# EAGLE design EXP_TMS9918A_V1 (EAGLE 9.6.2)
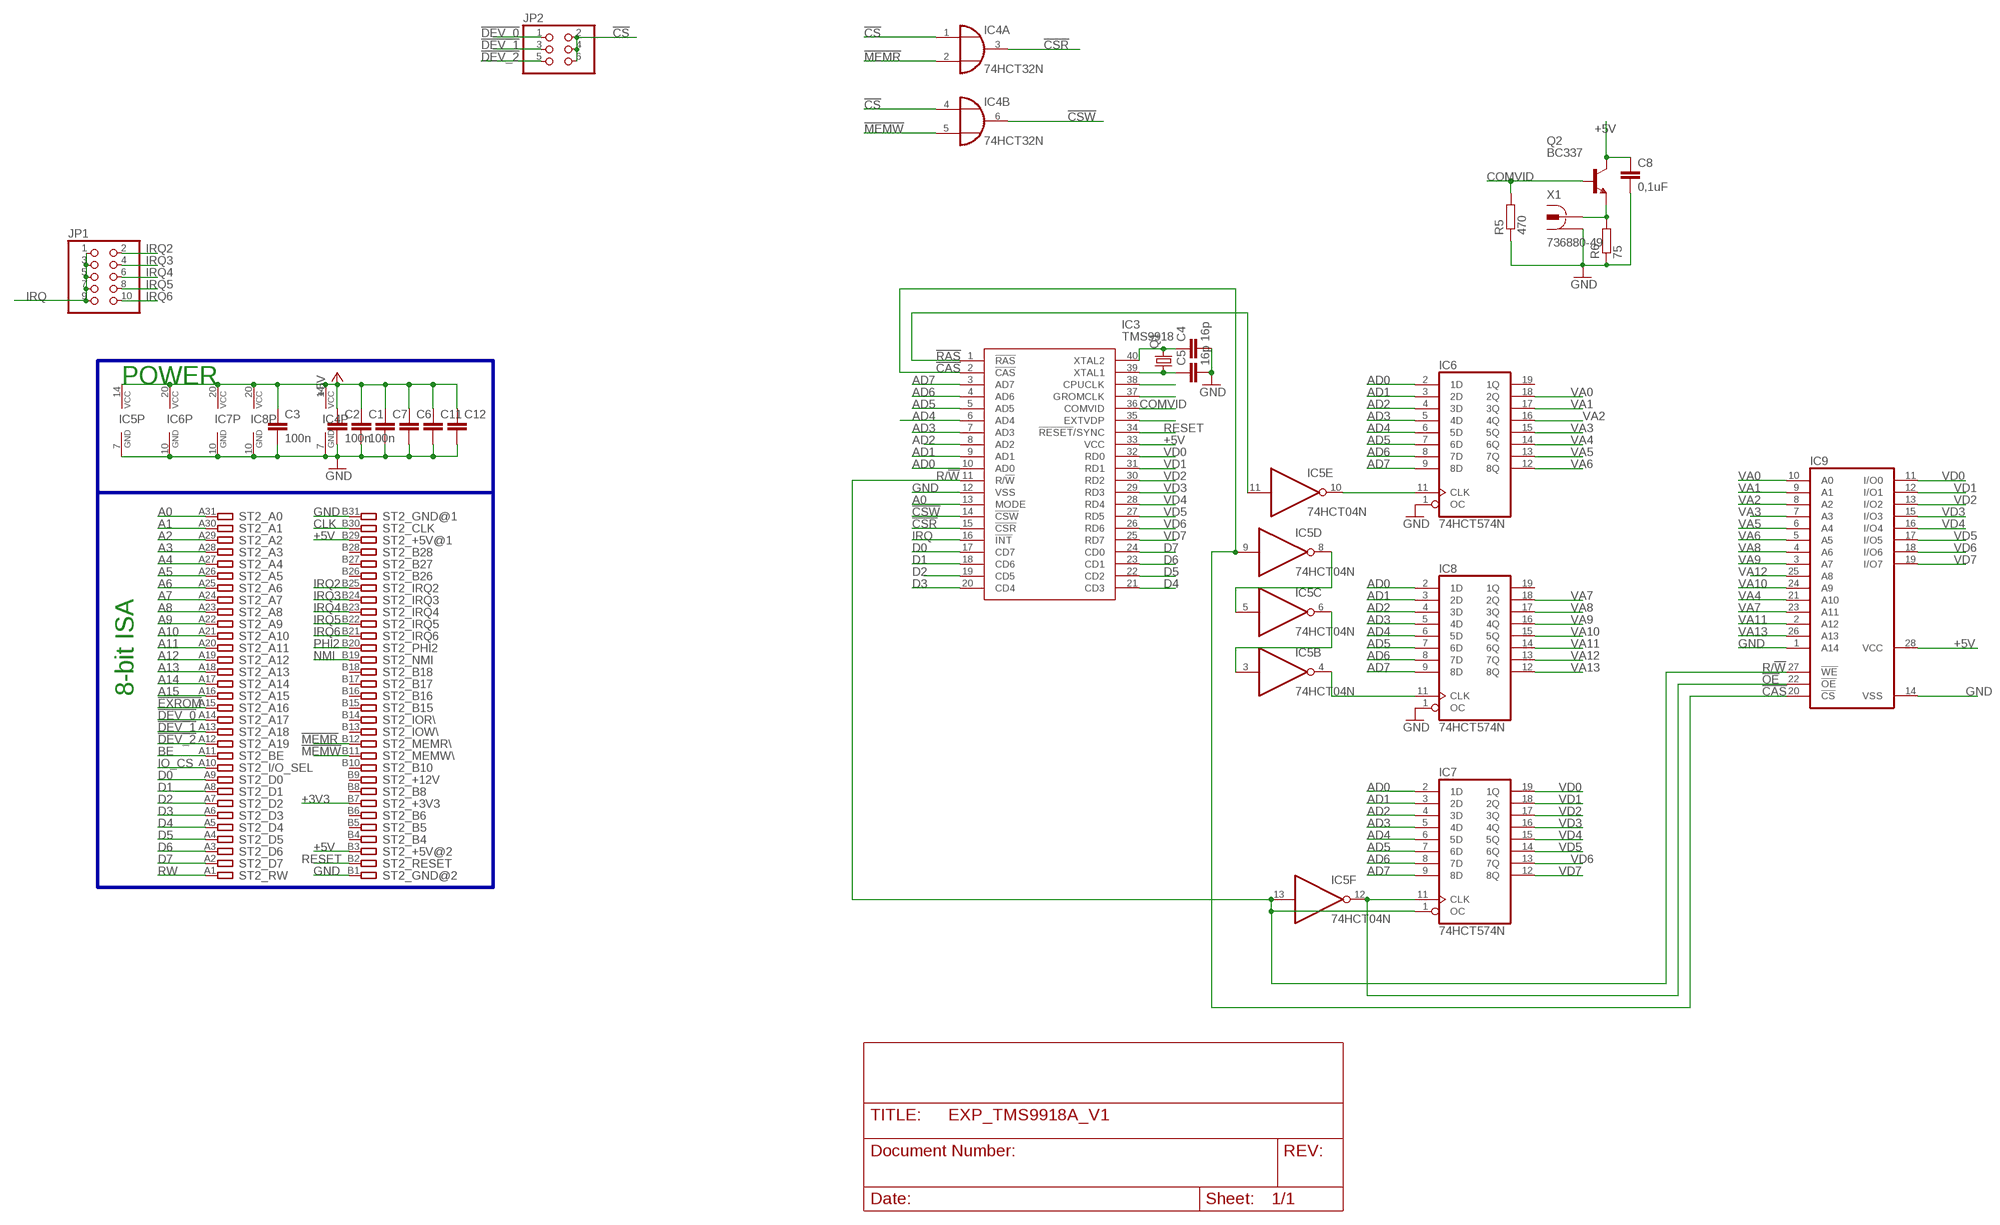
[diagram p0: schematic, sheet 1]

## Parts
C1  100n  C-EU050-025X075  [C050-025X075]
C2  100n  C-EU050-025X075  [C050-025X075]
C3  100n  C-EU050-025X075  [C050-025X075]
C4  16p  C-EU050-024X044  [C050-024X044]
C5  16p  C-EU050-024X044  [C050-024X044]
C6  C-EU050-035X075  [C050-035X075]
C7  C-EU050-035X075  [C050-035X075]
C8  0,1uF  C-EU050-024X044  [C050-024X044]
C11  C-EU050-035X075  [C050-035X075]
C12  C-EU050-035X075  [C050-035X075]
IC3  TMS9918  [DIP1524W53P254L5310H508Q40N]
IC4  74HCT32N  [DIL14]
IC5  74HCT04N  [DIL14]
IC6  74HCT574N  [DIL20]
IC7  74HCT574N  [DIL20]
IC8  74HCT574N  [DIL20]
IC9  62256P  [DIL28-6]
JP1  PINHD-2X5  [2X05]
JP2  PINHD-2X3  [2X03]
Q1  CRYSTALHC49S  [HC49/S]
Q2  BC337  [TO92]
R5  470  R-EU_0207/7  [0207/7]
R6  75  R-EU_0207/7  [0207/7]
ST2  IBM8BIT_ISASHORT  [APP_2X32_SHORT]
X1  736880-49  [736880-49]

## Nets
!CAS: IC3.2(!CAS) IC5.9(D:I) IC9.20(!CS)
!CS: IC4.1(A:I0) IC4.4(B:I0) JP2.2 JP2.4 JP2.6
!CSR: IC3.15(!CSR) IC4.3(A:O)
!CSW: IC3.14(!CSW) IC4.6(B:O)
!DEV_0: JP2.1 ST2.A14
!DEV_1: JP2.3 ST2.A13
!DEV_2: JP2.5 ST2.A12
!EXROM: ST2.A15
!MEMR: IC4.2(A:I1) ST2.B12
!MEMW: IC4.5(B:I1) ST2.B11
!OE: IC5.12(F:O) IC7.11(CLK) IC9.22(!OE)
!RAS: IC3.1(!RAS) IC5.11(E:I)
+3V3: ST2.B7
+5V [power]: C1.1 C2.1 C3.1 C6.1 C7.1 C8.1 C11.1 C12.1 IC3.33(VCC) IC4.14(P:VCC) IC5.14(P:VCC) IC6.20(VCC) IC7.20(VCC) IC8.20(VCC) IC9.28(VCC) Q2.3(C) ST2.B3 ST2.B29
A0: IC3.13(MODE) ST2.A31
A1: ST2.A30
A2: ST2.A29
A3: ST2.A28
A4: ST2.A27
A5: ST2.A26
A6: ST2.A25
A7: ST2.A24
A8: ST2.A23
A9: ST2.A22
A10: ST2.A21
A11: ST2.A20
A12: ST2.A19
A13: ST2.A18
A14: ST2.A17
A15: ST2.A16
AD0: IC3.10(AD0) IC6.2(1D) IC7.2(1D) IC8.2(1D)
AD1: IC3.9(AD1) IC6.3(2D) IC7.3(2D) IC8.3(2D)
AD2: IC3.8(AD2) IC6.4(3D) IC7.4(3D) IC8.4(3D)
AD3: IC3.7(AD3) IC6.5(4D) IC7.5(4D) IC8.5(4D)
AD4: IC3.6(AD4) IC6.6(5D) IC7.6(5D) IC8.6(5D)
AD5: IC3.5(AD5) IC6.7(6D) IC7.7(6D) IC8.7(6D)
AD6: IC3.4(AD6) IC6.8(7D) IC7.8(7D) IC8.8(7D)
AD7: IC3.3(AD7) IC6.9(8D) IC7.9(8D) IC8.9(8D)
BE: ST2.A11
CLK: ST2.B30
COMVID: IC3.36(COMVID) Q2.2(B) R5.2
D0: IC3.17(CD7) ST2.A9
D1: IC3.18(CD6) ST2.A8
D2: IC3.19(CD5) ST2.A7
D3: IC3.20(CD4) ST2.A6
D4: IC3.21(CD3) ST2.A5
D5: IC3.22(CD2) ST2.A4
D6: IC3.23(CD1) ST2.A3
D7: IC3.24(CD0) ST2.A2
GND [power]: C1.2 C2.2 C3.2 C4.2 C5.2 C6.2 C7.2 C8.2 C11.2 C12.2 IC3.12(VSS) IC4.7(P:GND) IC5.7(P:GND) IC6.1(OC) IC6.10(GND) IC7.10(GND) IC8.1(OC) IC8.10(GND) IC9.1(A14) IC9.14(VSS) R5.1 R6.1 ST2.B1 ST2.B31 X1.1 X1.1@1 X1.1@2
IO_CS: ST2.A10
IRQ: IC3.16(!INT) JP1.1 JP1.3 JP1.5 JP1.7 JP1.9
IRQ2: JP1.2 ST2.B25
IRQ3: JP1.4 ST2.B24
IRQ4: JP1.6 ST2.B23
IRQ5: JP1.8 ST2.B22
IRQ6: JP1.10 ST2.B21
N$3: Q2.1(E) R6.2 X1.2
N$14: IC5.10(E:O) IC6.11(CLK)
N$15: IC5.5(C:I) IC5.8(D:O)
N$16: IC5.3(B:I) IC5.6(C:O)
N$17: IC5.4(B:O) IC8.11(CLK)
N$22: C4.1 IC3.40(XTAL2) Q1.2
N$23: C5.1 IC3.39(XTAL1) Q1.1
N$24: IC3.38(CPUCLK)
N$25: IC3.37(GROMCLK)
N$27: IC3.35(EXTVDP)
NMI: ST2.B19
PHI2: ST2.B20
R/!W: IC3.11(R/!W) IC5.13(F:I) IC7.1(OC) IC9.27(!WE)
RESET: IC3.34(!RESET!/SYNC) ST2.B2
RW: ST2.A1
VA0: IC6.18(2Q) IC9.10(A0)
VA1: IC6.17(3Q) IC9.9(A1)
VA2: IC6.16(4Q) IC9.8(A2)
VA3: IC6.15(5Q) IC9.7(A3)
VA4: IC6.14(6Q) IC9.21(A10)
VA5: IC6.13(7Q) IC9.6(A4)
VA6: IC6.12(8Q) IC9.5(A5)
VA7: IC8.18(2Q) IC9.23(A11)
VA8: IC8.17(3Q) IC9.4(A6)
VA9: IC8.16(4Q) IC9.3(A7)
VA10: IC8.15(5Q) IC9.24(A9)
VA11: IC8.14(6Q) IC9.2(A12)
VA12: IC8.13(7Q) IC9.25(A8)
VA13: IC8.12(8Q) IC9.26(A13)
VD0: IC3.32(RD0) IC7.19(1Q) IC9.11(I/O0)
VD1: IC3.31(RD1) IC7.18(2Q) IC9.12(I/O1)
VD2: IC3.30(RD2) IC7.17(3Q) IC9.13(I/O2)
VD3: IC3.29(RD3) IC7.16(4Q) IC9.15(I/O3)
VD4: IC3.28(RD4) IC7.15(5Q) IC9.16(I/O4)
VD5: IC3.27(RD5) IC7.14(6Q) IC9.17(I/O5)
VD6: IC3.26(RD6) IC7.13(7Q) IC9.18(I/O6)
VD7: IC3.25(RD7) IC7.12(8Q) IC9.19(I/O7)
Unconnected: IC4.8(C:O) IC4.9(C:I0) IC4.10(C:I1) IC4.11(D:O) IC4.12(D:I0) IC4.13(D:I1) IC5.1(A:I) IC5.2(A:O) IC6.19(1Q) IC8.19(1Q) ST2.B4 ST2.B5 ST2.B6 ST2.B8 ST2.B9 ST2.B10 ST2.B13 ST2.B14 ST2.B15 ST2.B16 ST2.B17 ST2.B18 ST2.B26 ST2.B27 ST2.B28

## Buses
A8,A9,A10,A11,ACIA_CS,IO_CS,IO_CS_N,N$3,N$4,N$8

## Notes on the sheet
- POWER
- 8-bit ISA

## Library data of the parts
C1-C3 = rcl:C-EU: CAPACITOR, European symbol
C4-C8 C11 C12 = rcl:C-EU: CAPACITOR, European symbol; SPICEPREFIX: C
IC3 = TMS9918:TMS9918: Video Display Processor, DIP-40 Source: Datasheet <http://www.bitsavers.org/components/ti/TMS9900/TMS9918A_TMS9928A_TMS9929A_Video_Display_Processors_Data_Manual_Nov82.pdf>; DESCRIPTION: Video Display Processor, DIP-40; HEIGHT: 5.08mm; MANUFACTURER_NAME: Texas Instruments; MANUFACTURER_PART_NUMBER: TMS9918
IC4 = 74xx-eu:74*32: Quad 2-input OR gate
IC5 = 74xx-eu:74*04: Hex INVERTER
IC6-IC8 = 74xx-eu:74*574: 8-bit D type FLIP FLOP bus driver
IC9 = memory-hitachi:62256P: MEMORY; OC_FARNELL: unknown; OC_NEWARK: unknown
JP1 = pinhead:PINHD-2X5: PIN HEADER
JP2 = pinhead:PINHD-2X3: PIN HEADER
Q1 = crystal:CRYSTAL: CRYSTAL; OC_FARNELL: 1667008; OC_NEWARK: unknown
Q2 = transistor-npn:BC337*: NPN Transistor
R5 R6 = rcl:R-EU_: RESISTOR, European symbol; SPICEPREFIX: R
ST2 = TiRoRiN_Libs:IBM8BIT_ISA: 8-bit CARD IBM/PC-AT
X1 = con-conrad:736880-49: Cinch Connector ( RCA Jack ) Cinch-Einbaukupplung 90º 72345 Vernickelt BKL Electronic Source: Conrad <http://www.conrad.de/ce/de/product/736880>

## Net classes
0 default: width 0.381 mm, drill 0.2 mm, clearance 0.254 mm
1 power: width 0.508 mm, drill 0.66 mm, clearance 0.254 mm to class 0, clearance 0.254 mm
2 data: width 0.381 mm, drill 0.66 mm, clearance 0.254 mm to class 0, clearance 0.254 mm to class 1, clearance 0.254 mm

## Board
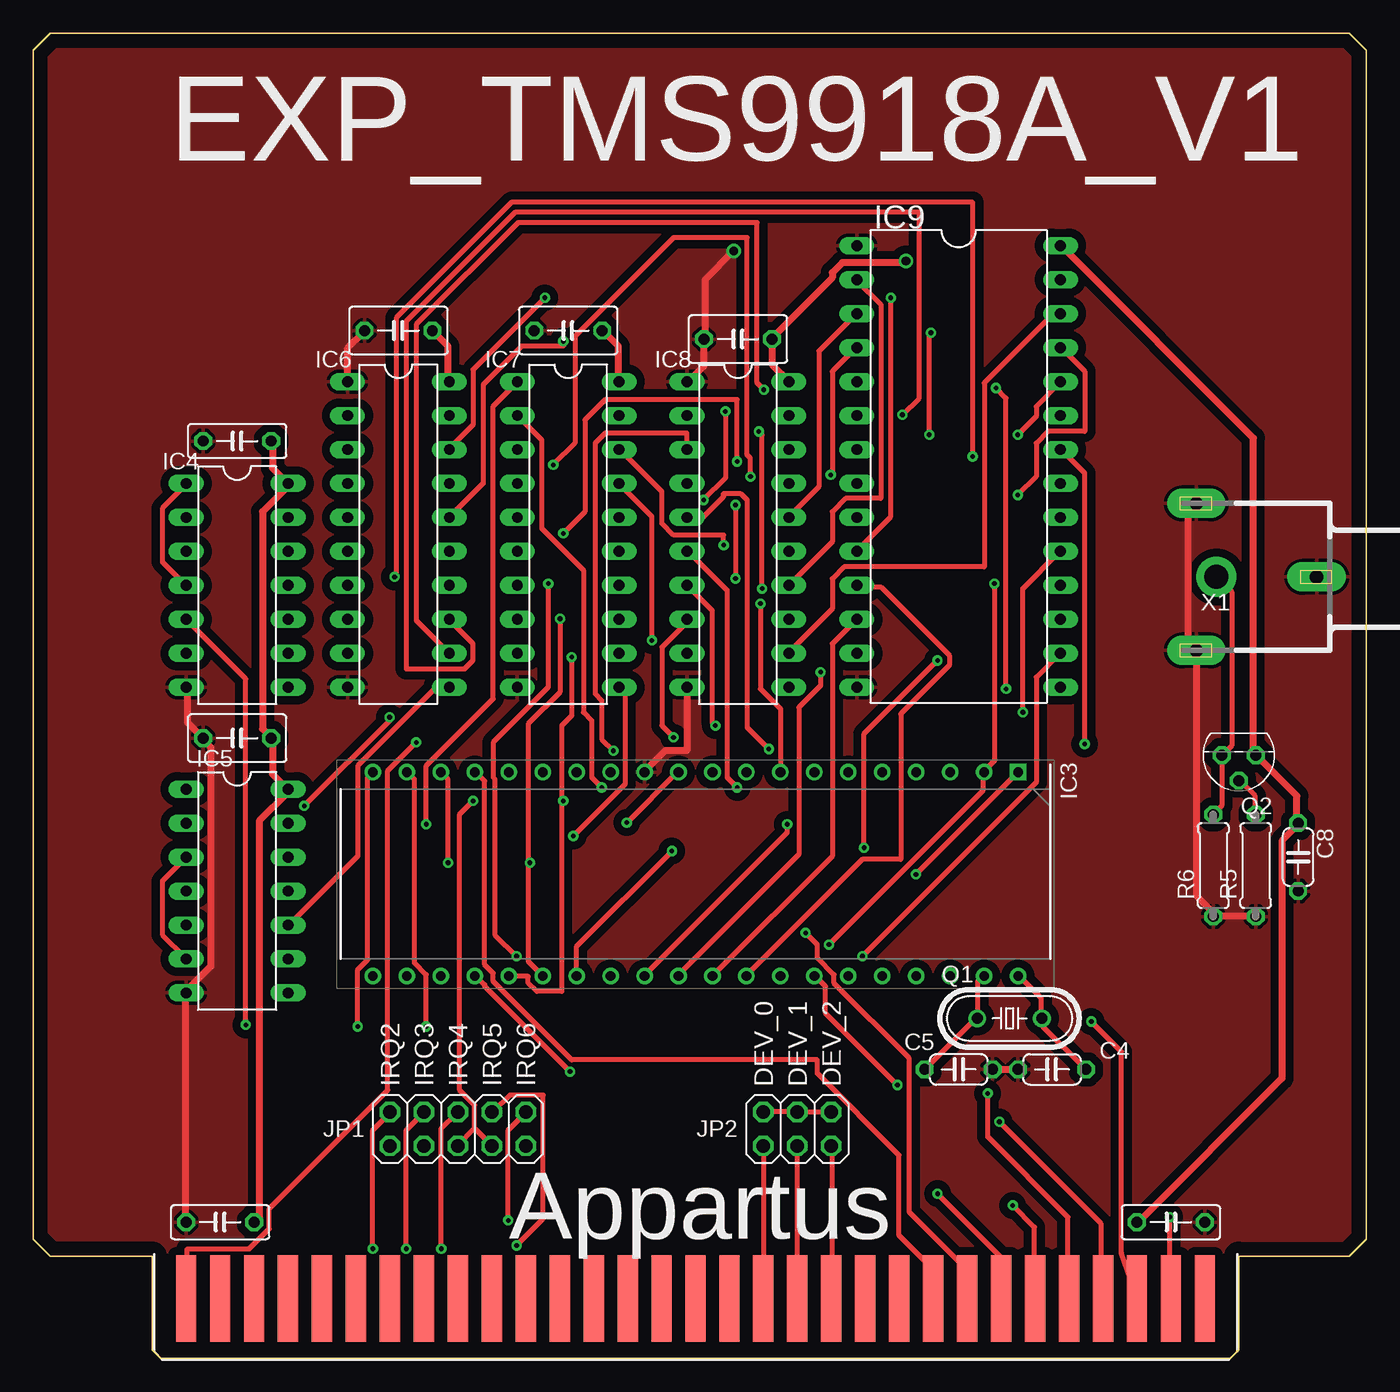
[diagram p1: board, top side]
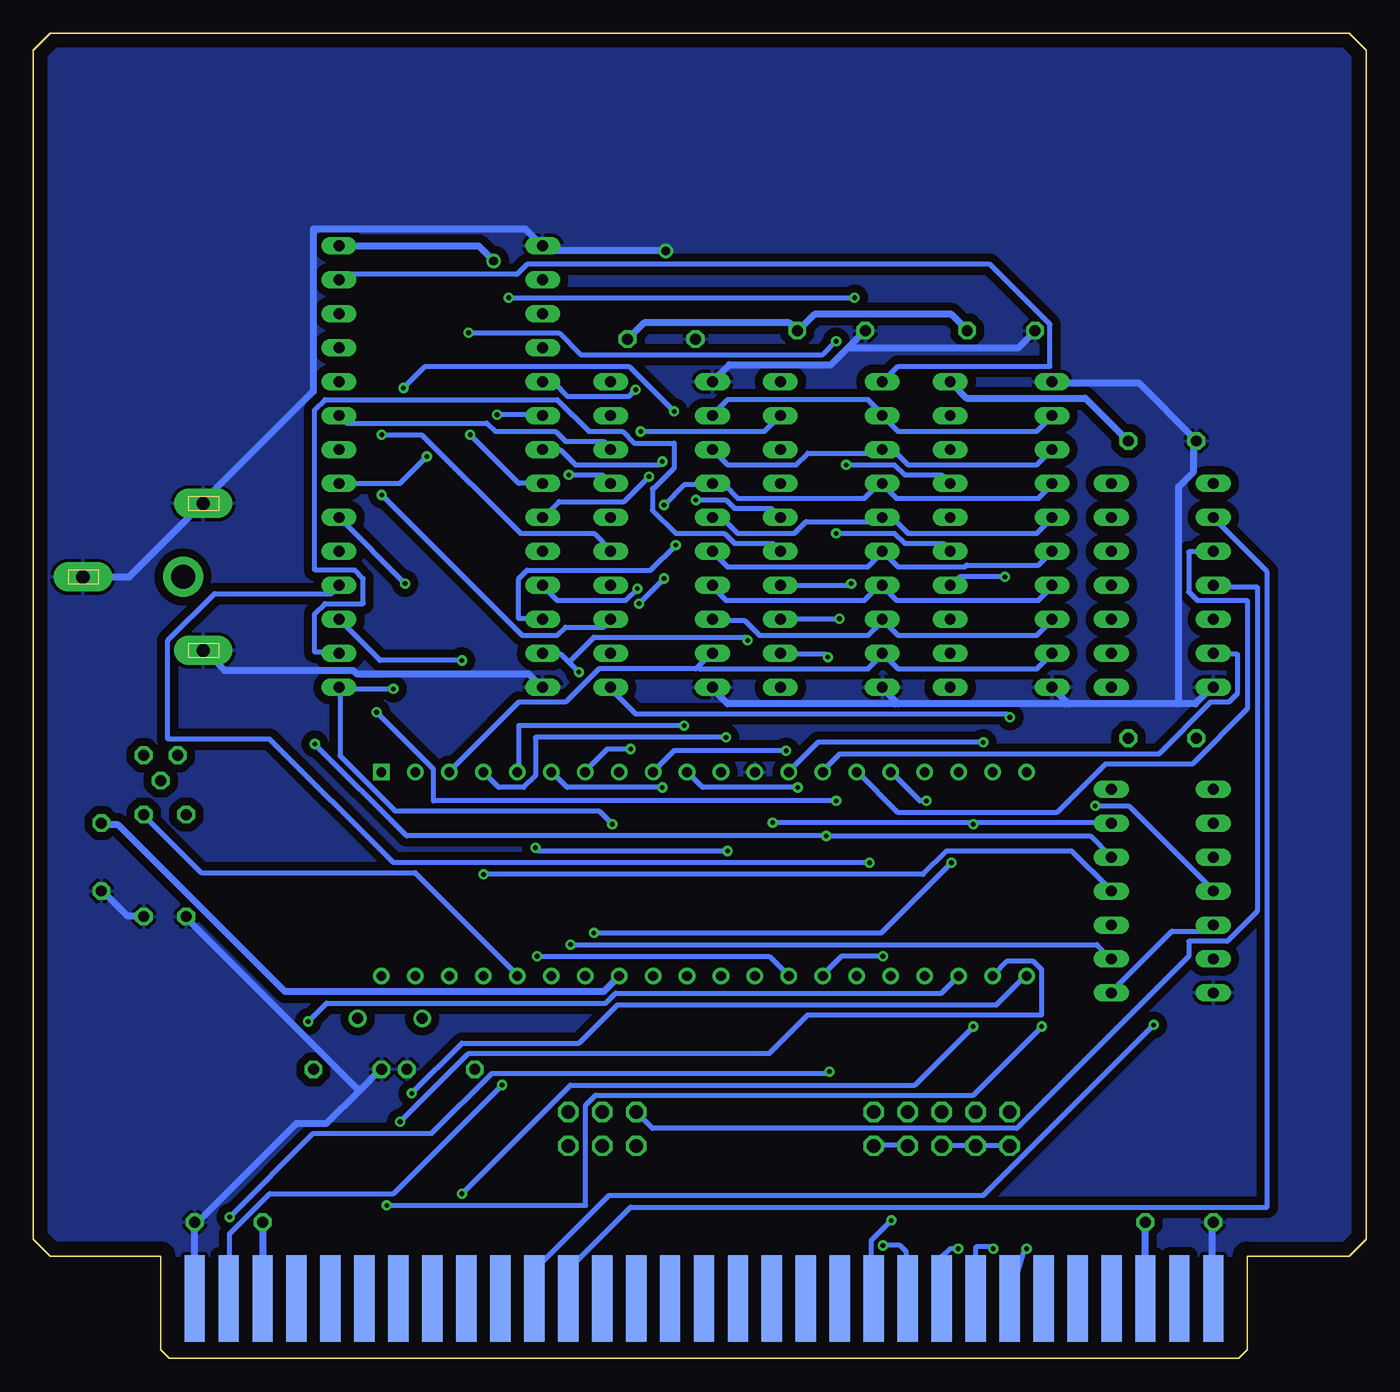
[diagram p2: board, bottom side, seen from below]

Size 99.7 x 99.06 mm. Coordinates in mm from the lower left corner, seen from the top.
Copper layers (1*16): Top 0.035mm / dielectric 1.5mm / Bottom 0.035mm
Design rules "appartus": minimum track width 6mil, minimum drill 0.35mm, track to track 6mil, track to pad 6mil, pad to pad 6mil, via to via 6mil, smd to smd 6mil, copper to edge 40mil, drill to drill 6mil, minimum pad ring 10mil, minimum via ring 8mil, stop-mask expansion 4mil, vias tented up to drill 0mil, thermal gap 10mil

### Footprints (pad centres in the part's own frame; a part is rotated, then mirrored left to right if it is on the bottom)
C050-025X075 = drill 0.813 octagon: 1 -2.54,0; 2 2.54,0
C050-024X044 = drill 0.813 octagon: 1 -2.54,0; 2 2.54,0
C050-035X075 = drill 0.813 octagon: 1 -2.54,0; 2 2.54,0
DIP1524W53P254L5310H508Q40N = drill 0.733 pad 1.133 square: 1 -7.62,24.13 | drill 0.733 pad 1.133: 2 -7.62,21.59; 3 -7.62,19.05; 4 -7.62,16.51; 5 -7.62,13.97; 6 -7.62,11.43; 7 -7.62,8.89; 8 -7.62,6.35; 9 -7.62,3.81; 10 -7.62,1.27; 11 -7.62,-1.27; 12 -7.62,-3.81; 13 -7.62,-6.35; 14 -7.62,-8.89; 15 -7.62,-11.43; 16 -7.62,-13.97; 17 -7.62,-16.51; 18 -7.62,-19.05; 19 -7.62,-21.59; 20 -7.62,-24.13; 21 7.62,-24.13; 22 7.62,-21.59; 23 7.62,-19.05; 24 7.62,-16.51; 25 7.62,-13.97; 26 7.62,-11.43; 27 7.62,-8.89; 28 7.62,-6.35; 29 7.62,-3.81; 30 7.62,-1.27; 31 7.62,1.27; 32 7.62,3.81; 33 7.62,6.35; 34 7.62,8.89; 35 7.62,11.43; 36 7.62,13.97; 37 7.62,16.51; 38 7.62,19.05; 39 7.62,21.59; 40 7.62,24.13
DIL14 = drill 0.813 long: 1 -7.62,-3.81; 2 -5.08,-3.81; 3 -2.54,-3.81; 4 0,-3.81; 5 2.54,-3.81; 6 5.08,-3.81; 7 7.62,-3.81; 8 7.62,3.81; 9 5.08,3.81; 10 2.54,3.81; 11 0,3.81; 12 -2.54,3.81; 13 -5.08,3.81; 14 -7.62,3.81
DIL20 = drill 0.813 long: 1 -11.43,-3.81; 2 -8.89,-3.81; 3 -6.35,-3.81; 4 -3.81,-3.81; 5 -1.27,-3.81; 6 1.27,-3.81; 7 3.81,-3.81; 8 6.35,-3.81; 9 8.89,-3.81; 10 11.43,-3.81; 11 11.43,3.81; 12 8.89,3.81; 13 6.35,3.81; 14 3.81,3.81; 15 1.27,3.81; 16 -1.27,3.81; 17 -3.81,3.81; 18 -6.35,3.81; 19 -8.89,3.81; 20 -11.43,3.81
DIL28-6 = drill 0.813 long: 1 -16.51,-7.62; 2 -13.97,-7.62; 3 -11.43,-7.62; 4 -8.89,-7.62; 5 -6.35,-7.62; 6 -3.81,-7.62; 7 -1.27,-7.62; 8 1.27,-7.62; 9 3.81,-7.62; 10 6.35,-7.62; 11 8.89,-7.62; 12 11.43,-7.62; 13 13.97,-7.62; 14 16.51,-7.62; 15 16.51,7.62; 16 13.97,7.62; 17 11.43,7.62; 18 8.89,7.62; 19 6.35,7.62; 20 3.81,7.62; 21 1.27,7.62; 22 -1.27,7.62; 23 -3.81,7.62; 24 -6.35,7.62; 25 -8.89,7.62; 26 -11.43,7.62; 27 -13.97,7.62; 28 -16.51,7.62
2X05 = drill 1.016 octagon: 1 -5.08,-1.27; 2 -5.08,1.27; 3 -2.54,-1.27; 4 -2.54,1.27; 5 0,-1.27; 6 0,1.27; 7 2.54,-1.27; 8 2.54,1.27; 9 5.08,-1.27; 10 5.08,1.27
2X03 = drill 1.016 octagon: 1 -2.54,-1.27; 2 -2.54,1.27; 3 0,-1.27; 4 0,1.27; 5 2.54,-1.27; 6 2.54,1.27
HC49/S = drill 0.813: 1 -2.413,0; 2 2.413,0
TO92 = drill 0.813 octagon: 1 1.27,0; 2 0,1.905; 3 -1.27,0
0207/7 = drill 0.813 octagon: 1 -3.81,0; 2 3.81,0
APP_2X32_SHORT = smd 1.524 x 6.477: A1 38.1,-44.45; A2 35.56,-44.45; A3 33.02,-44.45; A4 30.48,-44.45; A5 27.94,-44.45; A6 25.4,-44.45; A7 22.86,-44.45; A8 20.32,-44.45; A9 17.78,-44.45; A10 15.24,-44.45; A11 12.7,-44.45; A12 10.16,-44.45; A13 7.62,-44.45; A14 5.08,-44.45; A15 2.54,-44.45; A16 0,-44.45; A17 -2.54,-44.45; A18 -5.08,-44.45; A19 -7.62,-44.45; A20 -10.16,-44.45; A21 -12.7,-44.45; A22 -15.24,-44.45; A23 -17.78,-44.45; A24 -20.32,-44.45; A25 -22.86,-44.45; A26 -25.4,-44.45; A27 -27.94,-44.45; A28 -30.48,-44.45; A29 -33.02,-44.45; A30 -35.56,-44.45; A31 -38.1,-44.45 | smd 1.524 x 6.477 bottom: B1 38.1,-44.45; B2 35.56,-44.45; B3 33.02,-44.45; B4 30.48,-44.45; B5 27.94,-44.45; B6 25.4,-44.45; B7 22.86,-44.45; B8 20.32,-44.45; B9 17.78,-44.45; B10 15.24,-44.45; B11 12.7,-44.45; B12 10.16,-44.45; B13 7.62,-44.45; B14 5.08,-44.45; B15 2.54,-44.45; B16 0,-44.45; B17 -2.54,-44.45; B18 -5.08,-44.45; B19 -7.62,-44.45; B20 -10.16,-44.45; B21 -12.7,-44.45; B22 -15.24,-44.45; B23 -17.78,-44.45; B24 -20.32,-44.45; B25 -22.86,-44.45; B26 -25.4,-44.45; B27 -27.94,-44.45; B28 -30.48,-44.45; B29 -33.02,-44.45; B30 -35.56,-44.45; B31 -38.1,-44.45
736880-49 = drill 1 pad 2.2 long: 1 -3.92,0; 1@1 5.08,-5.5; 1@2 5.08,5.5 | drill 1.8 pad 3: 2 3.58,0

### Placement (x,y rotation side)
C1  13.97,10.16 180 top
C2  85.09,10.16 0 top
C3  15.24,68.58 180 top
C4  76.2,21.59 180 top
C5  69.22,21.59 0 top
C6  52.7,76.2 180 top
C7  15.24,46.36 180 top
C8  94.61,37.47 270 top
C11  27.3,76.84 180 top
C12  40.01,76.84 180 top
IC3  49.53,36.2 270 top
IC4  15.24,57.79 270 top
IC5  15.24,34.92 270 top
IC6  27.3,61.59 270 top
IC7  40.01,61.59 270 top
IC8  52.7,61.59 270 top
IC9  69.22,66.68 270 top
JP1  31.75,17.15 0 top
JP2  57.15,17.15 0 top
Q1  73.03,25.4 0 top
Q2  90.17,45.09 180 top
R5  91.44,36.83 90 top
R6  88.27,36.83 90 top
ST2  49.53,48.9 0 top
X1  92.08,58.42 180 top

### Tracks (layer width: path | path; a pad name or v marks a point on that pad's centre or on a via)
!CAS  (via drill 0.35)
  Top 0.381: v71.89,57.92 71.89,44.67 71.14,43.92 IC3.2 71.02,43.67 71.02,42.42 v59.52,30.92
  Bottom 0.381: IC9.20 v71.89,57.92 | v59.52,30.92 20.14,30.92 19.14,29.92 IC5.9
!CS
  Top 0.381: JP2.2 54.64,18.42 57.14,18.42 JP2.4 57.27,18.42 59.64,18.42 JP2.6 | IC4.4 11.39,57.8 9.64,59.55 9.64,63.55 11.39,65.3 IC4.1
  Bottom 0.381: JP2.2 54.52,18.3 53.39,17.17 26.14,17.17 13.27,30.05 13.27,31.17 10.39,31.17 8.14,33.42 8.14,57.67 11.39,57.67 IC4.4
!CSR
  Bottom 0.381: IC3.15 38.02,43.8 35.02,40.8 23.14,40.8 19.52,44.42 13.02,44.42 8.89,48.55 8.89,56.67 12.64,56.67 13.27,57.3 13.27,60.3 11.52,60.3 IC4.3
!CSW
  Bottom 0.381: IC3.14 40.64,43.92 39.39,45.17 15.52,45.17 11.64,49.05 10.27,49.05 9.64,49.67 9.64,52.67 11.39,52.67 IC4.6
!DEV_0
  Top 0.381: JP2.1 54.64,15.8 54.64,4.55 ST2.A14
!DEV_1
  Top 0.381: JP2.3 57.14,15.8 57.14,4.55 ST2.A13
!DEV_2
  Top 0.381: JP2.5 59.77,15.8 59.77,4.55 ST2.A12
!MEMR
  Bottom 0.381: IC4.2 11.39,62.8 7.39,58.8 7.39,11.3 55.02,11.3 59.64,6.67 59.64,4.55 ST2.B12
!MEMW  (via drill 0.35)
  Top 0.381: v15.89,24.92 15.89,50.8 11.52,55.17 IC4.5
  Bottom 0.381: v15.89,24.92 28.64,12.17 56.64,12.17 62.14,6.67 62.14,4.55 ST2.B11
!OE  (via drill 0.35)
  Top 0.381: v40.39,39.05 44.27,42.92 44.27,49.67 43.89,50.05 IC7.11 | v78.64,45.92 78.64,66.17 76.89,67.92 IC9.22
  Bottom 0.381: IC5.12 19.14,37.55 20.64,39.05 v40.39,39.05 71.77,39.05 v78.64,45.92
!RAS  (via drill 0.35)
  Top 0.381: v66.02,36.17 IC3.1
  Bottom 0.381: v66.02,36.17 33.14,36.17 31.39,37.92 22.02,37.92 19.14,35.05 IC5.11
+5V  (via drill 0.66)
  Top 0.508: IC8.20 56.52,73.05 55.27,74.3 55.27,76.17 C6.1 55.39,76.42 59.77,80.8 59.77,81.17 60.52,81.92 65.27,81.92 v65.27,82.05 | C12.1 42.64,76.8 43.77,75.67 43.77,73.05 IC7.20 | C3.1 17.89,68.55 17.89,66.55 19.02,65.42 IC4.14 19.02,65.17 17.14,63.3 17.14,47.05 17.64,46.55 C7.1 17.89,46.3 17.89,43.67 19.02,42.55 IC5.14 19.02,42.3 16.89,40.17 16.89,10.55 16.52,10.17 C1.1 | C11.1 29.89,76.8 31.02,75.67 31.02,73.05 IC6.20 | IC9.28 76.89,83.17 91.27,68.8 91.27,45.3 Q2.3 91.52,45.05 94.52,42.05 94.52,40.05 C8.1 94.52,39.8 93.39,38.67 93.39,20.92 82.64,10.17 C2.1
  Bottom 0.508: C6.1 55.14,76.3 54.02,77.42 43.14,77.42 42.64,76.92 C12.1 42.39,76.92 41.27,78.05 31.02,78.05 29.89,76.92 C11.1 | C1.1 16.52,10.05 16.52,4.55 ST2.B29 | C3.1 17.89,68.67 21.02,71.8 29.89,71.8 31.02,72.92 IC6.20 | C2.1 82.52,10.05 82.52,4.55 ST2.B3 | IC3.33 55.89,28.55 57.02,27.42 80.89,27.42 93.39,39.92 94.52,39.92 C8.1 | v65.27,82.05 66.39,83.17 76.77,83.17 IC9.28
A0  (via drill 0.35)
  Top 0.381: v28.64,46.05 26.52,43.92 26.52,20.05 17.64,11.17 17.64,9.67 16.14,8.17 11.52,8.17 11.52,4.55 ST2.A31
  Bottom 0.381: v28.64,46.05 41.02,46.05 43.14,43.92 IC3.13
AD0  (via drill 0.35)
  Top 0.381: v42.52,42.67 41.77,43.42 41.77,47.67 41.14,48.3 41.14,58.92 38.02,62.05 38.02,68.67 36.27,70.42 IC7.2
  Bottom 0.381: v42.52,42.67 49.64,42.67 50.77,43.8 IC3.10 | IC6.2 23.52,70.42 24.64,69.3 35.02,69.3 36.14,70.42 IC7.2 36.27,70.67 37.27,71.67 47.77,71.67 48.89,70.55 IC8.2
AD1  (via drill 0.35)
  Top 0.381: v43.39,45.42 42.52,46.3 42.52,49.17 42.02,49.67 42.02,68.42 42.77,69.17 48.89,69.17 48.89,68.05 IC8.3
  Bottom 0.381: IC6.3 23.52,67.92 24.64,66.8 34.27,66.8 35.39,67.92 36.14,67.92 IC7.3 36.27,67.8 36.39,67.67 41.77,67.67 42.64,66.8 47.77,66.8 48.89,67.92 IC8.3 | v43.39,45.42 51.77,45.42 53.27,43.92 IC3.9
AD2  (via drill 0.35)
  Top 0.381: v54.39,56.42 54.39,50.05 55.89,48.55 55.89,43.92 IC3.8 | v52.52,63.8 v52.52,58.3
  Bottom 0.381: IC6.4 23.52,65.3 24.52,64.3 35.14,64.3 36.14,65.3 IC7.4 36.39,65.42 37.52,64.3 47.02,64.3 48.02,65.3 48.77,65.3 IC8.4 49.02,65.3 51.02,65.3 v52.52,63.8 | v52.52,58.3 v54.39,56.42
AD3  (via drill 0.35)
  Top 0.381: v55.02,45.55 53.39,47.17 53.39,64.17 52.89,64.67 51.64,64.67 51.64,64.42 50.14,62.92 49.02,62.92 IC8.5
  Bottom 0.381: IC6.5 23.52,62.8 24.64,61.67 34.27,61.67 35.39,62.8 36.14,62.8 IC7.5 36.27,62.67 36.39,62.55 41.89,62.55 42.77,61.67 47.02,61.67 48.14,62.8 48.89,62.8 IC8.5 | v55.02,45.55 56.77,45.55 58.39,43.92 IC3.7
AD4  (via drill 0.35)
  Top 0.381: v52.64,42.67 51.89,43.42 51.89,57.42 49.02,60.3 IC8.6
  Bottom 0.381: IC6.6 23.52,60.3 24.52,59.3 29.89,59.3 30.02,59.17 35.02,59.17 36.14,60.3 IC7.6 36.27,60.17 37.27,59.17 47.77,59.17 48.89,60.3 IC8.6 | v52.64,42.67 59.77,42.67 60.89,43.8 IC3.6
AD5  (via drill 0.35)
  Top 0.381: v51.02,47.3 50.77,47.55 50.77,55.92 49.02,57.67 IC8.7
  Bottom 0.381: IC6.7 23.52,57.67 24.52,56.67 35.14,56.67 36.14,57.67 IC7.7 36.39,57.8 37.52,56.67 47.89,56.67 48.89,57.67 IC8.7 | v51.02,47.3 63.39,47.3 63.39,43.92 IC3.5
AD6  (via drill 0.35)
  Top 0.381: v47.89,46.42 47.02,47.3 47.02,53.17 48.89,55.05 48.89,55.17 IC8.8
  Bottom 0.381: IC6.8 23.52,55.17 24.64,54.05 35.02,54.05 36.14,55.17 IC7.8 36.27,55.05 37.27,54.05 45.39,54.05 46.52,55.17 48.89,55.17 IC8.8 | v47.89,46.42 62.14,46.42 62.14,43.55 63.02,42.67 64.89,42.67 66.02,43.8 IC3.4
AD7
  Bottom 0.381: IC6.9 23.52,52.67 24.64,51.55 35.02,51.55 36.14,52.67 IC7.9 36.27,52.55 37.27,51.55 49.89,51.55 50.02,51.67 | 50.02,51.67 49.02,52.67 IC8.9 | 50.02,51.67 50.14,51.55 57.39,51.55 59.89,49.05 63.39,49.05 68.52,43.92 IC3.3
COMVID
  Top 0.381: Q2.2 90.27,43.17 91.39,42.05 91.39,40.67 R5.2
  Bottom 0.381: IC3.36 63.52,28.67 71.14,36.3 87.14,36.3 91.39,40.55 R5.2
D0
  Top 0.381: IC3.17 33.14,43.8 33.77,43.17 33.77,29.42 34.39,28.8 34.39,28.17 40.27,22.3 58.64,22.3 58.64,21.3 64.77,15.17 64.77,9.17 67.27,6.67 67.27,4.55 ST2.A9
D1  (via drill 0.35)
  Top 0.381: v31.02,37.05 31.02,43.3 30.52,43.8 IC3.18 | v57.77,31.8 58.64,30.92 58.64,29.92 59.89,28.67 59.89,28.05 65.52,22.42 65.52,10.92 69.77,6.67 69.77,4.55 ST2.A8
  Bottom 0.381: v31.02,37.05 36.27,31.8 v57.77,31.8
D2  (via drill 0.35)
  Top 0.381: v29.39,24.8 29.39,28.67 28.52,29.55 28.52,43.3 28.02,43.8 IC3.19 | v67.64,12.3 72.39,7.55 ST2.A7
  Bottom 0.381: v29.39,24.8 33.77,20.42 59.52,20.42 v67.64,12.3
D3  (via drill 0.35)
  Top 0.381: v24.27,24.8 24.27,29.05 25.02,29.8 25.02,43.42 25.39,43.8 IC3.20 | v73.27,11.42 74.89,9.8 74.89,4.55 ST2.A6
  Bottom 0.381: v24.27,24.8 29.39,19.67 57.64,19.67 58.39,18.92 58.39,11.42 v73.27,11.42
D4  (via drill 0.35)
  Top 0.381: v71.39,19.8 71.39,16.55 77.39,10.55 77.39,4.55 ST2.A5
  Bottom 0.381: v71.39,19.8 67.64,23.55 58.89,23.55 56.02,26.42 27.64,26.42 25.52,28.55 IC3.21
D5  (via drill 0.35)
  Top 0.381: v72.27,17.67 79.89,10.05 79.89,4.55 ST2.A4
  Bottom 0.381: v72.27,17.67 67.14,22.8 44.64,22.8 41.77,25.67 24.27,25.67 24.27,29.05 24.89,29.67 26.89,29.67 27.89,28.67 IC3.22
D6  (via drill 0.35)
  Top 0.381: v79.14,25.17 81.39,22.92 81.39,7.85 82.55,4.54 ST2.A3
  Bottom 0.381: v79.14,25.17 77.77,26.55 56.89,26.55 56.14,27.3 31.77,27.3 30.52,28.55 IC3.23
D7  (via drill 0.35)
  Top 0.381: v40.14,21.42 33.77,27.8 33.77,27.92 33.14,28.55 IC3.24 | v85.02,10.55 85.02,4.55 ST2.A2
  Bottom 0.381: v40.14,21.42 40.27,21.3 65.39,21.3 69.89,16.8 78.77,16.8 v85.02,10.55
GND  (via drill 0.66)
  Top 0.508: X1.1@1 86.89,63.92 86.39,63.42 86.39,53.42 86.89,52.92 X1.1@2 87.02,52.67 87.02,34.55 88.27,33.3 R6.1 88.27,33.05 91.39,33.05 R5.1 | C5.2 71.77,21.55 73.64,21.55 C4.2 | C11.2 24.77,76.8 23.52,75.55 23.52,73.05 IC6.1 | IC8.1 49.02,73.05 50.14,74.17 50.14,76.17 C6.2 50.27,76.42 50.27,80.67 v52.39,82.8 | C1.2 11.39,10.17 11.39,27.3 IC5.7 11.52,27.55 13.27,29.3 13.27,45.67 12.77,46.17 C7.2 12.64,46.42 11.52,47.55 11.52,50.05 IC4.7 | IC3.12 45.77,43.92 47.27,45.42 48.89,45.42 48.89,50.05 IC8.10
  Bottom 0.508: X1.1 92.52,58.42 87.02,63.92 X1.1@1 86.89,64.17 78.77,72.3 78.77,84.42 62.89,84.42 61.77,83.3 IC9.1 61.52,83.17 61.14,82.8 v52.39,82.8 | IC9.14 61.64,50.17 62.64,51.17 75.52,51.17 75.77,51.42 85.39,51.42 86.89,52.92 X1.1@2 | C8.2 94.52,34.92 92.64,33.05 91.52,33.05 R5.1 | ST2.B1 87.64,4.55 87.64,10.05 C2.2 87.39,10.17 80.02,17.55 77.77,17.55 75.27,20.05 | 75.27,20.05 73.77,21.55 C4.2 | R6.1 88.27,32.92 75.52,20.17 75.39,20.17 75.27,20.05 | IC6.1 23.39,72.92 17.02,72.92 12.77,68.67 C3.2 12.89,68.42 12.89,66.3 14.02,65.17 14.02,48.92 | 38.64,75.67 40.02,74.3 47.64,74.3 48.89,73.05 IC8.1 | 38.64,75.67 37.52,76.8 C12.2 | C11.2 24.77,76.8 26.02,75.55 38.52,75.55 38.64,75.67 | C1.2 11.52,10.05 11.52,4.55 ST2.B31 | 22.39,49.05 22.27,48.92 14.02,48.92 | 22.39,49.05 23.39,50.05 IC6.10 | 14.02,48.92 12.77,48.92 11.64,50.05 11.52,50.05 IC4.7 | 35.14,49.05 35.02,48.92 22.52,48.92 22.39,49.05 | 35.14,49.05 36.14,50.05 IC7.10 | IC8.10 48.89,50.05 47.77,48.92 35.27,48.92 35.14,49.05
  pour Top (isolate 0.61): -5.08,100.97 102.87,100.97 102.87,7.62 -5.08,7.62
  pour Bottom (isolate 0.61): 106.05,100.97 -1.9,100.97 -1.9,7.62 106.05,7.62
IRQ  (via drill 0.35)
  Top 0.381: v32.89,41.67 31.89,40.67 31.89,20.05 33.02,18.92 33.02,17.17 | 33.02,17.17 31.77,15.92 JP1.5 | 33.02,17.17 34.27,15.92 JP1.7
  Bottom 0.381: JP1.1 26.77,15.92 29.14,15.92 JP1.3 29.39,15.92 31.64,15.92 JP1.5 | v32.89,41.67 33.39,41.67 35.52,43.8 IC3.16 | JP1.9 36.77,15.92 34.39,15.92 JP1.7
IRQ2  (via drill 0.35)
  Top 0.381: v25.39,8.17 25.39,17.05 26.64,18.3 JP1.2
  Bottom 0.381: v25.39,8.17 25.52,8.3 ST2.B25
IRQ3  (via drill 0.35)
  Top 0.381: v27.89,8.17 27.89,17.05 29.14,18.3 JP1.4
  Bottom 0.381: v27.89,8.17 28.08,8.36 29.14,8.36 29.21,8.26 ST2.B24
IRQ4  (via drill 0.35)
  Top 0.381: v30.52,8.17 30.52,17.17 31.64,18.3 JP1.6
  Bottom 0.381: ST2.B23 31.75,7.62 31.15,8.17 v30.52,8.17
IRQ5  (via drill 0.35)
  Top 0.381: v36.14,8.42 38.14,10.42 38.14,19.67 35.64,19.67 34.39,18.42 JP1.8
  Bottom 0.381: v36.14,8.42 34.87,8.42 34.39,7.94 34.39,4.55 ST2.B22
IRQ6  (via drill 0.35)
  Top 0.381: v35.52,10.3 35.52,17.05 36.77,18.3 JP1.10
  Bottom 0.381: v35.52,10.3 37.02,8.8 37.02,4.55 36.89,4.55 ST2.B21
N$3
  Top 0.381: R6.2 88.27,40.67 88.89,41.3 88.89,45.05 Q2.1 89.02,45.17 89.64,45.8 89.64,57.3 88.52,58.42 X1.2
N$14
  Top 0.381: IC5.10 19.14,32.42 24.27,37.55 24.27,44.3 30.02,50.05 31.02,50.05 IC6.11
N$15
  Bottom 0.381: IC5.5 11.52,32.3 11.89,31.92 14.52,31.92 19.02,27.42 IC5.8
N$16
  Top 0.381: IC5.6 11.39,29.92 9.64,31.67 9.64,35.67 11.39,37.42 IC5.3
N$17  (via drill 0.35)
  Top 0.381: v20.27,41.3 26.64,47.67 v26.64,47.92
  Bottom 0.381: v20.27,41.3 17.77,41.3 11.52,35.05 IC5.4 | v26.64,47.92 26.89,48.17 54.64,48.17 56.52,50.05 IC8.11
N$22
  Top 0.381: IC3.40 73.77,28.55 75.39,26.92 75.39,25.42 Q1.2 75.52,25.3 75.52,24.8 78.64,21.67 C4.1
N$23
  Top 0.381: IC3.39 71.02,28.55 70.64,28.17 70.64,25.42 Q1.1 70.52,25.42 66.77,21.67 C5.1
R/!W  (via drill 0.35)
  Top 0.381: v44.39,40.05 48.14,43.8 IC3.11 | v29.39,39.92 29.39,44.3 34.39,49.3 34.39,71.17 36.14,72.92 IC7.1
  Bottom 0.381: 29.39,40.05 19.14,40.05 IC5.13 | 29.39,40.05 v44.39,40.05 | v29.39,39.92 29.39,40.05 | IC9.27 76.77,80.67 76.39,81.05 63.52,81.05 62.77,81.8 28.14,81.8 23.64,77.3 23.64,74.17 35.02,74.17 36.14,73.05 IC7.1
RESET  (via drill 0.35)
  Top 0.381: v64.64,20.42 59.27,25.8 59.27,27.8 58.52,28.55 IC3.34
  Bottom 0.381: v64.64,20.42 72.77,12.3 82.02,12.3 85.02,9.3 85.02,4.55 ST2.B2
VA0  (via drill 0.35)
  Top 0.381: v38.27,79.3 32.89,73.92 32.89,69.8 31.14,68.05 IC6.18 | v64.14,79.3 64.14,62.92 61.64,60.42 IC9.10
  Bottom 0.381: v64.14,79.3 v38.27,79.3
VA1  (via drill 0.35)
  Top 0.381: v38.89,66.8 40.52,68.42 40.52,76.42 47.89,83.8 53.39,83.8 53.39,67.55 53.64,67.3 v53.64,65.92
  Bottom 0.381: v38.89,66.8 35.27,66.8 34.52,66.05 31.77,66.05 31.14,65.42 IC6.17 | v53.64,65.92 55.52,64.05 60.39,64.05 61.52,62.92 IC9.9
VA2  (via drill 0.35)
  Top 0.381: v39.64,76.05 39.64,75.67 36.52,75.67 33.64,72.8 33.64,65.42 31.14,62.92 IC6.16 | v67.14,76.67 67.02,76.55 v67.02,69.05
  Bottom 0.381: v39.64,76.05 40.64,75.05 58.77,75.05 60.39,76.67 v67.14,76.67 | v67.02,69.05 63.39,65.42 61.64,65.42 IC9.8
VA3  (via drill 0.35)
  Top 0.381: v39.64,61.67 41.27,63.3 41.27,70.17 42.77,71.67 52.64,71.67 v52.64,67.05
  Bottom 0.381: v39.64,61.67 35.27,61.67 34.52,60.92 31.64,60.92 31.14,60.42 IC6.15 | v52.64,67.05 52.89,66.8 59.14,66.8 60.27,67.92 61.52,67.92 IC9.7
VA4  (via drill 0.35)
  Top 0.381: v27.02,58.42 27.14,58.55 27.14,77.8 35.77,86.42 70.27,86.42 v70.27,67.42
  Bottom 0.381: v27.02,58.42 30.39,58.42 31.02,57.8 IC6.14 | v70.27,67.42 72.27,65.42 76.77,65.42 IC9.21
VA5  (via drill 0.35)
  Top 0.381: v65.02,70.55 66.27,71.8 66.27,85.67 36.02,85.67 27.89,77.55 27.89,51.55 32.27,51.55 32.89,52.17 32.89,53.42 31.14,55.17 IC6.13
  Bottom 0.381: v65.02,70.55 61.64,70.55 IC9.6
VA6  (via drill 0.35)
  Top 0.381: v54.64,72.42 54.14,72.92 54.14,84.92 36.27,84.92 28.64,77.3 28.64,55.17 31.02,52.8 IC6.12
  Bottom 0.381: v54.64,72.42 55.14,71.92 59.77,71.92 60.77,72.92 61.52,72.92 IC9.5
VA7
  Bottom 0.381: IC8.18 56.52,68.05 57.02,68.55 59.89,68.55 60.64,69.3 65.14,69.3 65.77,69.92 76.27,69.92 76.77,70.42 IC9.23
VA8  (via drill 0.35)
  Top 0.381: v59.64,66.05 59.77,66.17 59.77,73.8 61.52,75.55 IC9.4
  Bottom 0.381: v59.64,66.05 57.14,66.05 56.52,65.42 IC8.17
VA9
  Top 0.381: IC8.16 56.52,62.92 58.77,65.17 58.77,75.3 61.52,78.05 IC9.3
VA10  (via drill 0.35)
  Top 0.381: v73.64,69.05 75.02,70.42 75.02,71.17 76.77,72.92 IC9.24
  Bottom 0.381: v73.64,69.05 70.64,69.05 63.27,61.67 57.77,61.67 56.52,60.42 IC8.15
VA11
  Top 0.381: IC8.14 59.77,61.05 59.77,63.3 60.77,64.3 63.39,64.3 63.39,78.8 61.64,80.55 IC9.2
VA12  (via drill 0.35)
  Top 0.381: v73.64,64.55 75.02,65.92 75.02,68.42 75.89,69.3 78.64,69.3 78.64,73.8 76.89,75.55 IC9.25
  Bottom 0.381: v73.64,64.55 63.14,54.05 60.52,54.05 59.89,54.67 57.02,54.67 56.52,55.17 IC8.13
VA13
  Top 0.381: IC8.12 56.52,52.8 59.77,56.05 59.77,58.3 60.64,59.17 71.14,59.17 71.14,72.92 76.27,78.05 76.77,78.05 IC9.26
VD0  (via drill 0.35)
  Top 0.381: IC3.32 53.39,28.67 62.02,37.3 64.89,37.3 64.89,48.17 68.52,51.8 68.52,52.55 63.39,57.67 61.64,57.67 IC9.11 | v54.27,69.3 54.52,69.05 v54.52,57.55
  Bottom 0.381: v54.27,69.3 45.02,69.3 43.89,70.42 IC7.19 | v54.52,57.55 55.39,56.67 60.52,56.67 61.52,57.67 IC9.11
VD1  (via drill 0.35)
  Top 0.381: IC3.31 50.89,28.67 59.77,37.55 59.77,53.42 61.52,55.17 IC9.12 | v51.64,60.8 51.64,61.55 47.89,61.55 47.02,62.42 47.02,64.8 43.89,67.92 IC7.18
  Bottom 0.381: v51.64,60.8 53.52,58.92 62.77,58.92 63.39,58.3 63.39,55.3 61.64,55.3 IC9.12
VD2  (via drill 0.35)
  Top 0.381: v58.89,51.3 58.89,50.3 57.27,48.67 57.27,37.67 48.27,28.67 IC3.30 | v46.27,53.67 46.27,62.92 43.89,65.3 IC7.17
  Bottom 0.381: 59.64,52.05 60.27,52.67 61.52,52.67 IC9.13 | 59.64,52.05 v58.89,51.3 | v46.27,53.67 46.52,53.92 57.77,53.92 59.64,52.05
VD3  (via drill 0.35)
  Top 0.381: v56.39,39.92 56.39,39.3 45.77,28.67 IC3.29 | v50.14,64.17 51.77,65.8 v51.77,70.8 | v72.02,72.55 72.77,71.8 v72.77,50.05
  Bottom 0.381: v56.39,39.92 57.39,40.92 72.64,40.92 76.77,45.05 76.77,50.05 IC9.15 76.64,50.05 v72.77,50.05 | v50.14,64.17 47.89,64.17 47.27,63.55 44.52,63.55 43.89,62.92 IC7.16 | v51.77,70.8 55.14,74.17 70.39,74.17 v72.02,72.55
VD4  (via drill 0.35)
  Top 0.381: v62.02,30.05 75.02,43.05 75.02,50.92 76.77,52.67 IC9.16
  Bottom 0.381: v62.02,30.05 44.64,30.05 43.27,28.67 IC3.28 | IC7.15 43.89,60.42 44.39,60.92 47.27,60.92 48.02,61.67 51.64,61.67 53.39,63.42 53.39,65.05 53.27,65.05 51.77,66.55 51.77,68.42 54.77,68.42 55.64,69.3 58.14,69.3 60.52,71.67 77.89,71.67 78.64,70.92 78.64,58.92 75.64,58.92 75.02,58.3 75.02,56.42 77.89,56.42 78.64,55.67 78.64,52.8 76.89,52.8 IC9.16
VD5  (via drill 0.35)
  Top 0.381: v36.14,30.05 34.52,31.67 34.52,43.3 34.39,43.42 34.39,46.05 38.52,50.17 v38.52,57.92 | v67.64,52.17 62.14,46.67 v62.14,38.17 | v47.77,37.92 40.64,30.8 IC3.27
  Bottom 0.381: v36.14,30.05 39.27,30.05 40.64,28.67 IC3.27 | v38.52,57.92 38.64,57.8 43.77,57.8 IC7.14 | v67.64,52.17 73.77,52.17 76.77,55.17 IC9.17 | v62.14,38.17 61.89,37.92 v47.77,37.92
VD6  (via drill 0.35)
  Top 0.381: 37.02,37.05 37.02,47.42 39.39,49.8 v39.39,55.3 | 37.02,37.05 37.02,29.67 38.02,28.67 IC3.26 | v37.14,37.05 37.02,37.05
  Bottom 0.381: v39.39,55.3 43.77,55.3 IC7.13 | v37.14,37.05 72.77,37.05 82.02,46.3 89.64,46.3 89.64,53.67 86.14,57.17 77.39,57.17 76.89,57.67 IC9.18
VD7  (via drill 0.35)
  Top 0.381: 39.52,41.67 39.52,47.3 40.27,48.05 v40.27,52.42 | 39.52,41.67 39.52,27.42 37.64,27.42 37.02,28.05 37.02,28.55 35.64,28.55 IC3.25 | v74.02,48.3 74.02,57.55 76.77,60.3 IC9.19 | v39.64,41.67 39.52,41.67
  Bottom 0.381: v40.27,52.42 40.52,52.67 43.77,52.67 IC7.12 | v74.02,48.3 69.77,44.05 69.77,41.67 v39.64,41.67

### Text on the board
tNames: EXP_TMS9918A_V1 | IRQ2 | IRQ3 | IRQ4 | IRQ5 | IRQ6 | DEV_0 | DEV_1 | DEV_2